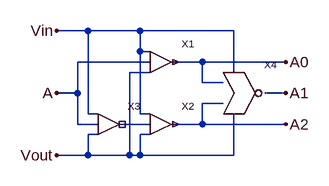
[diagram p0: schematic Decoder.asc]
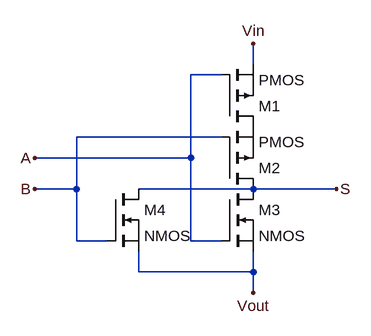
[diagram p1: sub-circuit nor.asc]
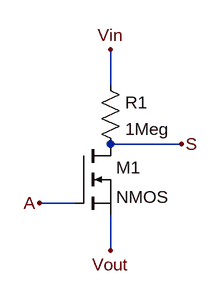
[diagram p2: sub-circuit nnot.asc]
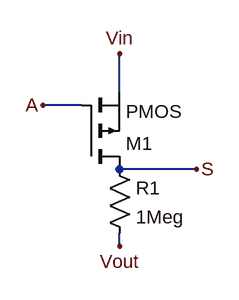
[diagram p3: sub-circuit pnot.asc]
Decoder.asc, the LTspice schematic file:
Version 4
SHEET 1 880 680
WIRE 192 64 144 64
WIRE 272 64 192 64
WIRE 416 64 272 64
WIRE 272 96 272 64
WIRE 288 96 272 96
WIRE 288 112 176 112
WIRE 368 112 320 112
WIRE 496 112 368 112
WIRE 288 128 256 128
WIRE 416 128 416 64
WIRE 368 144 368 112
WIRE 400 144 368 144
WIRE 176 160 176 112
WIRE 176 160 144 160
WIRE 496 160 464 160
WIRE 400 176 368 176
WIRE 192 192 192 64
WIRE 208 192 192 192
WIRE 272 192 272 96
WIRE 288 192 272 192
WIRE 176 208 176 160
WIRE 208 208 176 208
WIRE 288 208 240 208
WIRE 368 208 368 176
WIRE 368 208 320 208
WIRE 496 208 368 208
WIRE 208 224 192 224
WIRE 288 224 272 224
WIRE 192 256 192 224
WIRE 192 256 144 256
WIRE 256 256 256 128
WIRE 256 256 192 256
WIRE 272 256 272 224
WIRE 272 256 256 256
WIRE 416 256 416 192
WIRE 416 256 272 256
FLAG 144 160 A
FLAG 144 64 Vin
FLAG 144 256 Vout
FLAG 496 112 A0
FLAG 496 160 A1
FLAG 496 208 A2
SYMBOL NOR 464 160 R0
SYMATTR InstName X4
SYMBOL NNOT 320 112 R0
SYMATTR InstName X1
SYMBOL NNOT 320 208 R0
SYMATTR InstName X2
SYMBOL PNOT 240 208 R0
SYMATTR InstName X3

nor.asc, the sub-circuit schematic file:
Version 4
SHEET 1 880 680
WIRE 288 32 288 0
WIRE 240 48 192 48
WIRE 240 144 16 144
WIRE 192 176 192 48
WIRE 192 176 -48 176
WIRE 16 224 16 144
WIRE 16 224 -48 224
WIRE 288 224 112 224
WIRE 416 224 288 224
WIRE 16 304 16 224
WIRE 64 304 16 304
WIRE 192 304 192 176
WIRE 240 304 192 304
WIRE 112 352 112 320
WIRE 288 352 288 320
WIRE 288 352 112 352
WIRE 288 384 288 352
FLAG 288 0 Vin
FLAG -48 176 A
FLAG -48 224 B
FLAG 416 224 S
FLAG 288 384 Vout
SYMBOL pmos 240 128 M180
SYMATTR InstName M1
SYMBOL pmos 240 224 M180
SYMATTR InstName M2
SYMBOL nmos 240 224 R0
SYMATTR InstName M3
SYMBOL nmos 64 224 R0
SYMATTR InstName M4

nnot.asc, the sub-circuit schematic file:
Version 4
SHEET 1 880 680
WIRE 176 96 176 48
WIRE 272 176 176 176
WIRE 128 256 80 256
WIRE 176 320 176 272
FLAG 176 48 Vin
FLAG 80 256 A
FLAG 176 320 Vout
FLAG 272 176 S
SYMBOL res 160 80 R0
SYMATTR InstName R1
SYMATTR Value 1Meg
SYMATTR SpiceLine tol=1 pwr=0.1
SYMBOL nmos 128 176 R0
SYMATTR InstName M1

pnot.asc, the sub-circuit schematic file:
Version 4
SHEET 1 880 680
WIRE 224 112 224 64
WIRE 176 128 128 128
WIRE 320 208 224 208
WIRE 224 304 224 288
FLAG 128 128 A
FLAG 224 64 Vin
FLAG 320 208 S
FLAG 224 304 Vout
SYMBOL pmos 176 208 M180
SYMATTR InstName M1
SYMBOL res 208 192 R0
SYMATTR InstName R1
SYMATTR Value 1Meg
SYMATTR SpiceLine tol=1 pwr=0.1

The netlist it stands for:
* Decoder.asc
XX4 A1 A0 A2 Vin Vout nor
XX1 Vin A Vout A0 nnot
XX2 Vin N001 Vout A2 nnot
XX3 A Vin Vout N001 pnot

* block symbol definitions
.subckt nor S A B Vin Vout
M1 P001 A Vin Vin PMOS
M2 S B P001 P001 PMOS
M3 S A Vout Vout NMOS
M4 S B Vout Vout NMOS
.ends nor

.subckt nnot Vin A Vout S
R1 Vin S 1Meg tol=1 pwr=0.1
M1 S A Vout Vout NMOS
.ends nnot

.subckt pnot A Vin Vout S
M1 S A Vin Vin PMOS
R1 S Vout 1Meg tol=1 pwr=0.1
.ends pnot

.model NMOS NMOS
.model PMOS PMOS
.lib standard.mos
.backanno
.end